# EAGLE schematic SeparationPCB (EAGLE 9.6.2)
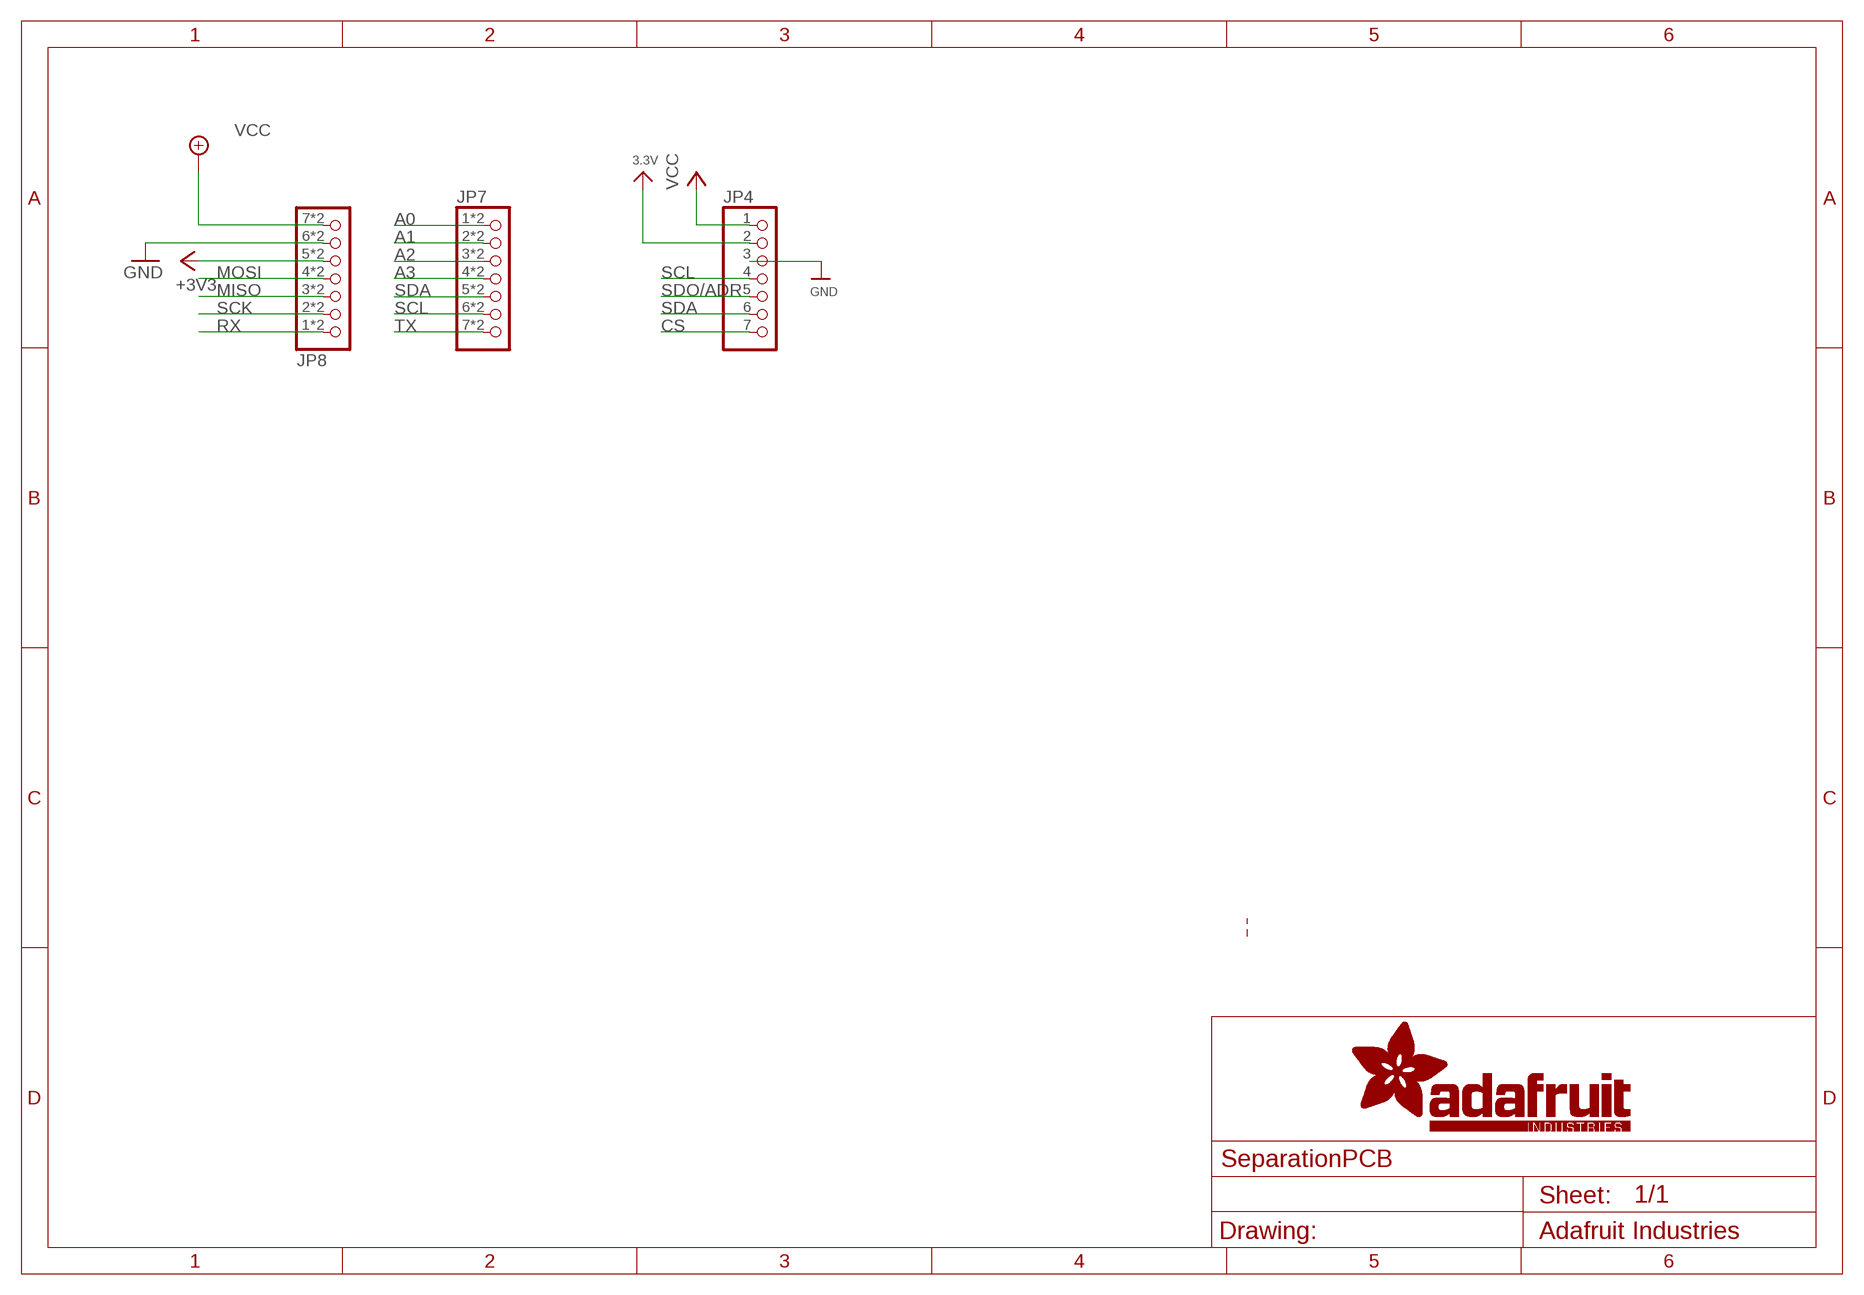
[diagram p0: schematic, sheet 1]

## Parts
JP4  HEADER-1X770MIL  [1X07_ROUND_70]
JP7  HEADER-1X7_CASTEL  [1X07_CASTEL]
JP8  HEADER-1X7_CASTEL  [1X07_CASTEL]

## Nets
3.3V [lowpower]: JP4.2
+3V3: JP8.5 JP8.5C
A0: JP7.1 JP7.1C
A1: JP7.2 JP7.2C
A2: JP7.3 JP7.3C
A3: JP7.4 JP7.4C
CS: JP4.7
GND [power]: JP4.3 JP8.6 JP8.6C
MISO: JP8.3 JP8.3C
MOSI: JP8.4 JP8.4C
RX: JP8.1 JP8.1C
SCK: JP8.2 JP8.2C
SCL: JP4.4 JP7.6 JP7.6C
SDA: JP4.6 JP7.5 JP7.5C
SDO/ADR: JP4.5
TX: JP7.7 JP7.7C
VCC [power]: JP4.1 JP8.7 JP8.7C ; supply symbol labelled +5V

## Library data of the parts
JP4 JP7 JP8 = microbuilder:HEADER-1X7: PIN HEADER

## Net classes
1 power: width 0.305 mm
2 lowpower: width 0.305 mm, drill 0.483 mm